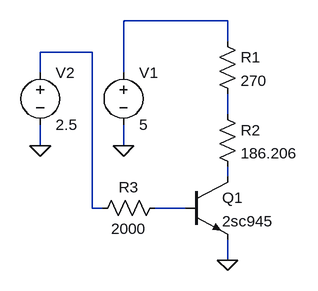
[diagram p0: schematic Key. Scheme. LTspice XVII.asc]
Key. Scheme. LTspice XVII.asc, the LTspice schematic file:
Version 4
SHEET 1 880 680
WIRE 256 -144 96 -144
WIRE 256 -112 256 -144
WIRE 48 -96 -32 -96
WIRE -32 -64 -32 -96
WIRE 96 -64 96 -144
WIRE 256 0 256 -32
WIRE -32 48 -32 16
WIRE 96 48 96 16
WIRE 256 96 256 80
WIRE 48 144 48 -96
WIRE 64 144 48 144
WIRE 192 144 144 144
WIRE 256 224 256 192
FLAG 96 48 0
FLAG -32 48 0
FLAG 256 224 0
SYMBOL npn 192 96 R0
SYMATTR InstName Q1
SYMATTR Value 2sc945
SYMBOL res 240 -128 R0
SYMATTR InstName R1
SYMATTR Value 270
SYMBOL res 240 -16 R0
SYMATTR InstName R2
SYMATTR Value 186.206
SYMBOL res 160 128 R90
WINDOW 0 0 56 VBottom 2
WINDOW 3 32 56 VTop 2
SYMATTR InstName R3
SYMATTR Value 2000
SYMBOL voltage 96 -80 R0
WINDOW 123 0 0 Left 0
WINDOW 39 0 0 Left 0
SYMATTR InstName V1
SYMATTR Value 5
SYMBOL voltage -32 -80 R0
WINDOW 123 0 0 Left 0
WINDOW 39 0 0 Left 0
SYMATTR InstName V2
SYMATTR Value 2.5

The netlist it stands for:
* Key. Scheme. LTspice XVII.asc
Q1 N004 N005 0 0 2sc945
R1 N001 N003 270
R2 N003 N004 186.206
R3 N005 N002 2000
V1 N001 0 5
V2 N002 0 2.5
.model NPN NPN
.model PNP PNP
.lib standard.bjt
.backanno
.end